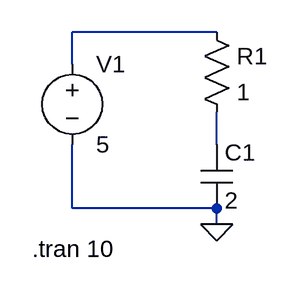
[diagram p0: schematic Draft1.asc]
Draft1.asc, the LTspice schematic file:
Version 4.1
SHEET 1 880 680
WIRE 208 128 64 128
WIRE 64 160 64 128
WIRE 208 240 208 208
WIRE 64 304 64 240
WIRE 208 304 64 304
WIRE 208 320 208 304
FLAG 208 320 0
SYMBOL voltage 64 144 R0
SYMATTR InstName V1
SYMATTR Value 5
SYMBOL res 192 112 R0
SYMATTR InstName R1
SYMATTR Value 1
SYMBOL cap 192 240 R0
SYMATTR InstName C1
SYMATTR Value 2
TEXT 24 344 Left 2 !.tran 10

The netlist it stands for:
* Draft1.asc
V1 N001 0 5
R1 N001 N002 1
C1 N002 0 2
.tran 10
.backanno
.end